# Altium schematic sheet 02-MCU.SchDoc
size A4
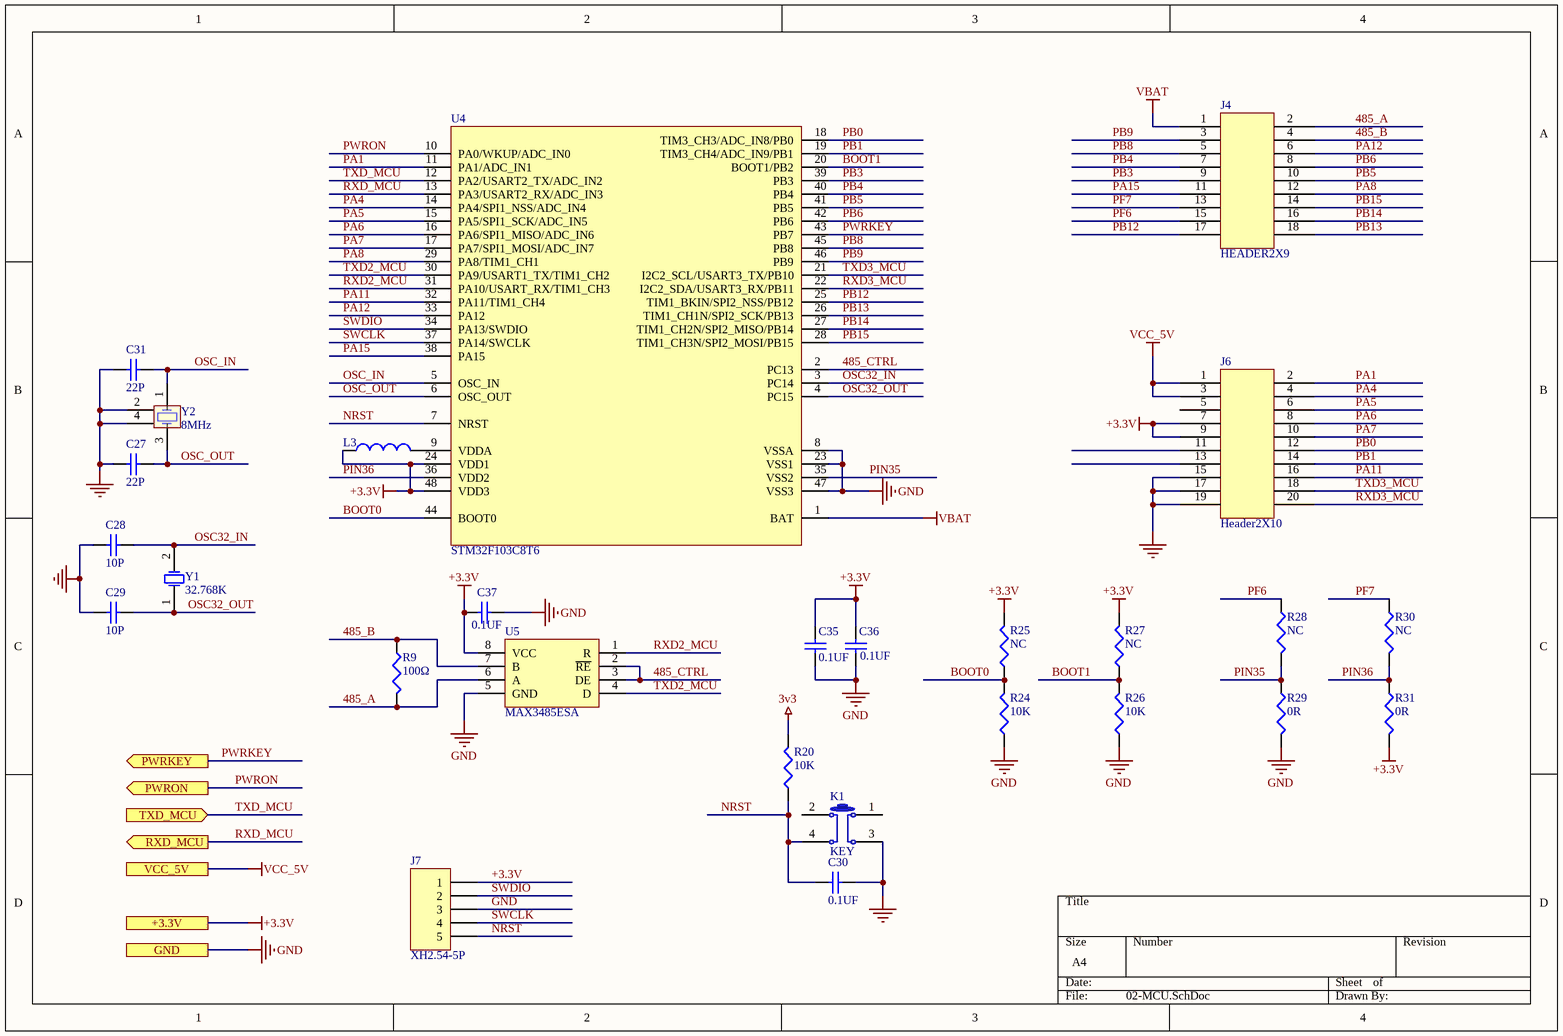
[diagram p0: 02-MCU.SchDoc]

## Parts
C27  value 22P  [0603_C]  (hidden comment: Cap)
C28  value 10P  [0603_C]  (hidden comment: Cap)
C29  value 10P  [0603_C]  (hidden comment: Cap)
C30  value 0.1UF  [0603_C]  (hidden comment: Cap)
C31  value 22P  [0603_C]  (hidden comment: Cap)
C35  value 0.1UF  [0603_C]  (hidden comment: Cap)
C36  value 0.1UF  [0603_C]  (hidden comment: Cap)
C37  value 0.1UF  [0603_C]  (hidden comment: Cap)
J4  HEADER2X9  [DSP1.27-1.27-18]
J6  Header2X10  [DSP1.27-1.27-20]
J7  XH2.54-5P  [SIP5]
K1  KEY  [KEY_SMD5465]
L3  Inductor  [0603_R]  (value not drawn)
R9  100Ω  [0603_R]
R20  value 10K  [0603_R]  (hidden comment: Res3)
R24  value 10K  [0603_R]  (hidden comment: Res3)
R25  value NC  [0603_R]  (hidden comment: Res3)
R26  value 10K  [0603_R]  (hidden comment: Res3)
R27  value NC  [0603_R]  (hidden comment: Res3)
R28  value NC  [0603_R]  (hidden comment: Res3)
R29  value 0R  [0603_R]  (hidden comment: Res3)
R30  value NC  [0603_R]  (hidden comment: Res3)
R31  value 0R  [0603_R]  (hidden comment: Res3)
U4  STM32F103C8T6  [LQFP48]
U5  MAX3485ESA  [SO8]
Y1  32.768K  [3215]
Y2  8MHz  [CRY_S3225]

## Ports
+3.3V, GND, PWRKEY, PWRON, RXD_MCU, TXD_MCU, VCC_5V

## Nets
3v3: R20.2
+3.3V: C35.1 C36.1 C37.1 J6.7 J6.9 J7.1 L3.1 R25.2 R27.2 R31.2 U4.24(VDD1) U4.48(VDD3) U5.8(VCC) ; port +3.3V
GND: C27.2 C28.2 C29.2 C30.1 C31.2 C35.2 C36.2 C37.2 J6.15 J6.17 J6.19 J7.3 K1.3 R24.1 R26.1 R29.2 U4.8(VSSA) U4.23(VSS1) U4.47(VSS3) U5.5(GND) Y2.2 Y2.4 ; port GND
VBAT: J4.1 U4.1(BAT)
VCC_5V: J6.1 J6.3 ; port VCC_5V
485_A: J4.2 R9.2 U5.6(A)
485_B: J4.4 R9.1 U5.7(B)
485_CTRL: U4.2(PC13) U5.2(~{RE}) U5.3(DE)
BOOT0: R24.2 R25.1 U4.44(BOOT0)
BOOT1: R26.2 R27.1 U4.20(BOOT1/PB2)
NRST: C30.2 J7.5 K1.4 R20.1 U4.7(NRST)
OSC32_IN: C28.1 U4.3(PC14) Y1.2(OSC2)
OSC32_OUT: C29.1 U4.4(PC15) Y1.1(OSC1)
OSC_IN: C31.1 U4.5(OSC_IN) Y2.1
OSC_OUT: C27.1 U4.6(OSC_OUT) Y2.3
PA1: J6.2 U4.11(PA1/ADC_IN1)
PA4: J6.4 U4.14(PA4/SPI1_NSS/ADC_IN4)
PA5: J6.6 U4.15(PA5/SPI1_SCK/ADC_IN5)
PA6: J6.8 U4.16(PA6/SPI1_MISO/ADC_IN6)
PA7: J6.10 U4.17(PA7/SPI1_MOSI/ADC_IN7)
PA8: J4.12 U4.29(PA8/TIM1_CH1)
PA11: J6.16 U4.32(PA11/TIM1_CH4)
PA12: J4.6 U4.33(PA12)
PA15: J4.11 U4.38(PA15)
PB0: J6.12 U4.18(TIM3_CH3/ADC_IN8/PB0)
PB1: J6.14 U4.19(TIM3_CH4/ADC_IN9/PB1)
PB3: J4.9 U4.39(PB3)
PB4: J4.7 U4.40(PB4)
PB5: J4.10 U4.41(PB5)
PB6: J4.8 U4.42(PB6)
PB8: J4.5 U4.45(PB8)
PB9: J4.3 U4.46(PB9)
PB12: J4.17 U4.25(TIM1_BKIN/SPI2_NSS/PB12)
PB13: J4.18 U4.26(TIM1_CH1N/SPI2_SCK/PB13)
PB14: J4.16 U4.27(TIM1_CH2N/SPI2_MISO/PB14)
PB15: J4.14 U4.28(TIM1_CH3N/SPI2_MOSI/PB15)
PF6: J4.15 R28.1
PF7: J4.13 R30.1
PIN35: R28.2 R29.1 U4.35(VSS2)
PIN36: R30.2 R31.1 U4.36(VDD2)
PWRKEY: U4.43(PB7) ; port PWRKEY
PWRON: U4.10(PA0/WKUP/ADC_IN0) ; port PWRON
RXD2_MCU: U4.31(PA10/USART_RX/TIM1_CH3) U5.1(R)
RXD3_MCU: J6.20 U4.22(I2C2_SDA/USART3_RX/PB11)
RXD_MCU: U4.13(PA3/USART2_RX/ADC_IN3) ; port RXD_MCU
SWCLK: J7.4 U4.37(PA14/SWCLK)
SWDIO: J7.2 U4.34(PA13/SWDIO)
TXD2_MCU: U4.30(PA9/USART1_TX/TIM1_CH2) U5.4(D)
TXD3_MCU: J6.18 U4.21(I2C2_SCL/USART3_TX/PB10)
TXD_MCU: U4.12(PA2/USART2_TX/ADC_IN2) ; port TXD_MCU
NetL3_2: L3.2 U4.9(VDDA)

Not connected (* = marked no-connect by the designer): J6 5 11 13; K1 1 2

## Library data of the parts
C27-C31 C35-C37 = Cap: Capacitor; Published: 8-Jun-2000; LatestRevisionDate: 17-Jul-2002; LatestRevisionNote: Re-released for DXP Platform.; PackageReference: RAD-0.3; Publisher: Altium Limited
J7 = Header 5H: Header, 5-Pin, Right Angle; LatestRevisionDate: 17-Jul-2002; LatestRevisionNote: Re-released for DXP Platform.; Publisher: Altium Limited
L3 = Inductor: Code_IEC: 1005; Value: GZ1608D601TF; Published: 8-Jun-2000; LatestRevisionDate: 17-Jul-2002; LatestRevisionNote: Re-released for DXP Platform.; PackageReference: 0402-A; Publisher: Altium Limited; Code_JEITA: 0402
R9 = RES1
R20 R24-R31 = Res3: Resistor; Published: 8-Jun-2000; LatestRevisionDate: 04-Mar-2005; LatestRevisionNote: PCB Footprint replaced.; PackageReference: J1-0603; Publisher: Altium Limited
U5 = MAX485
Y1 = XTAL: Crystal Oscillator; Published: 8-Jun-2000; LatestRevisionDate: 17-Jul-2002; LatestRevisionNote: Re-released for DXP Platform.; PackageReference: R38; Publisher: Altium Limited
Y2 = CRYSTAL_S4_1: CRYSTAL_S4_PASSIVE